# EAGLE schematic ACE2NOKB (EAGLE 9.4.2)
Jupiter Ace Schematic from Bodo Wenzels images. Checked against other sources. With edge connectors from https://jupiter-ace.co.uk/hardware_pcb_eagle.html. John Bradley 2019
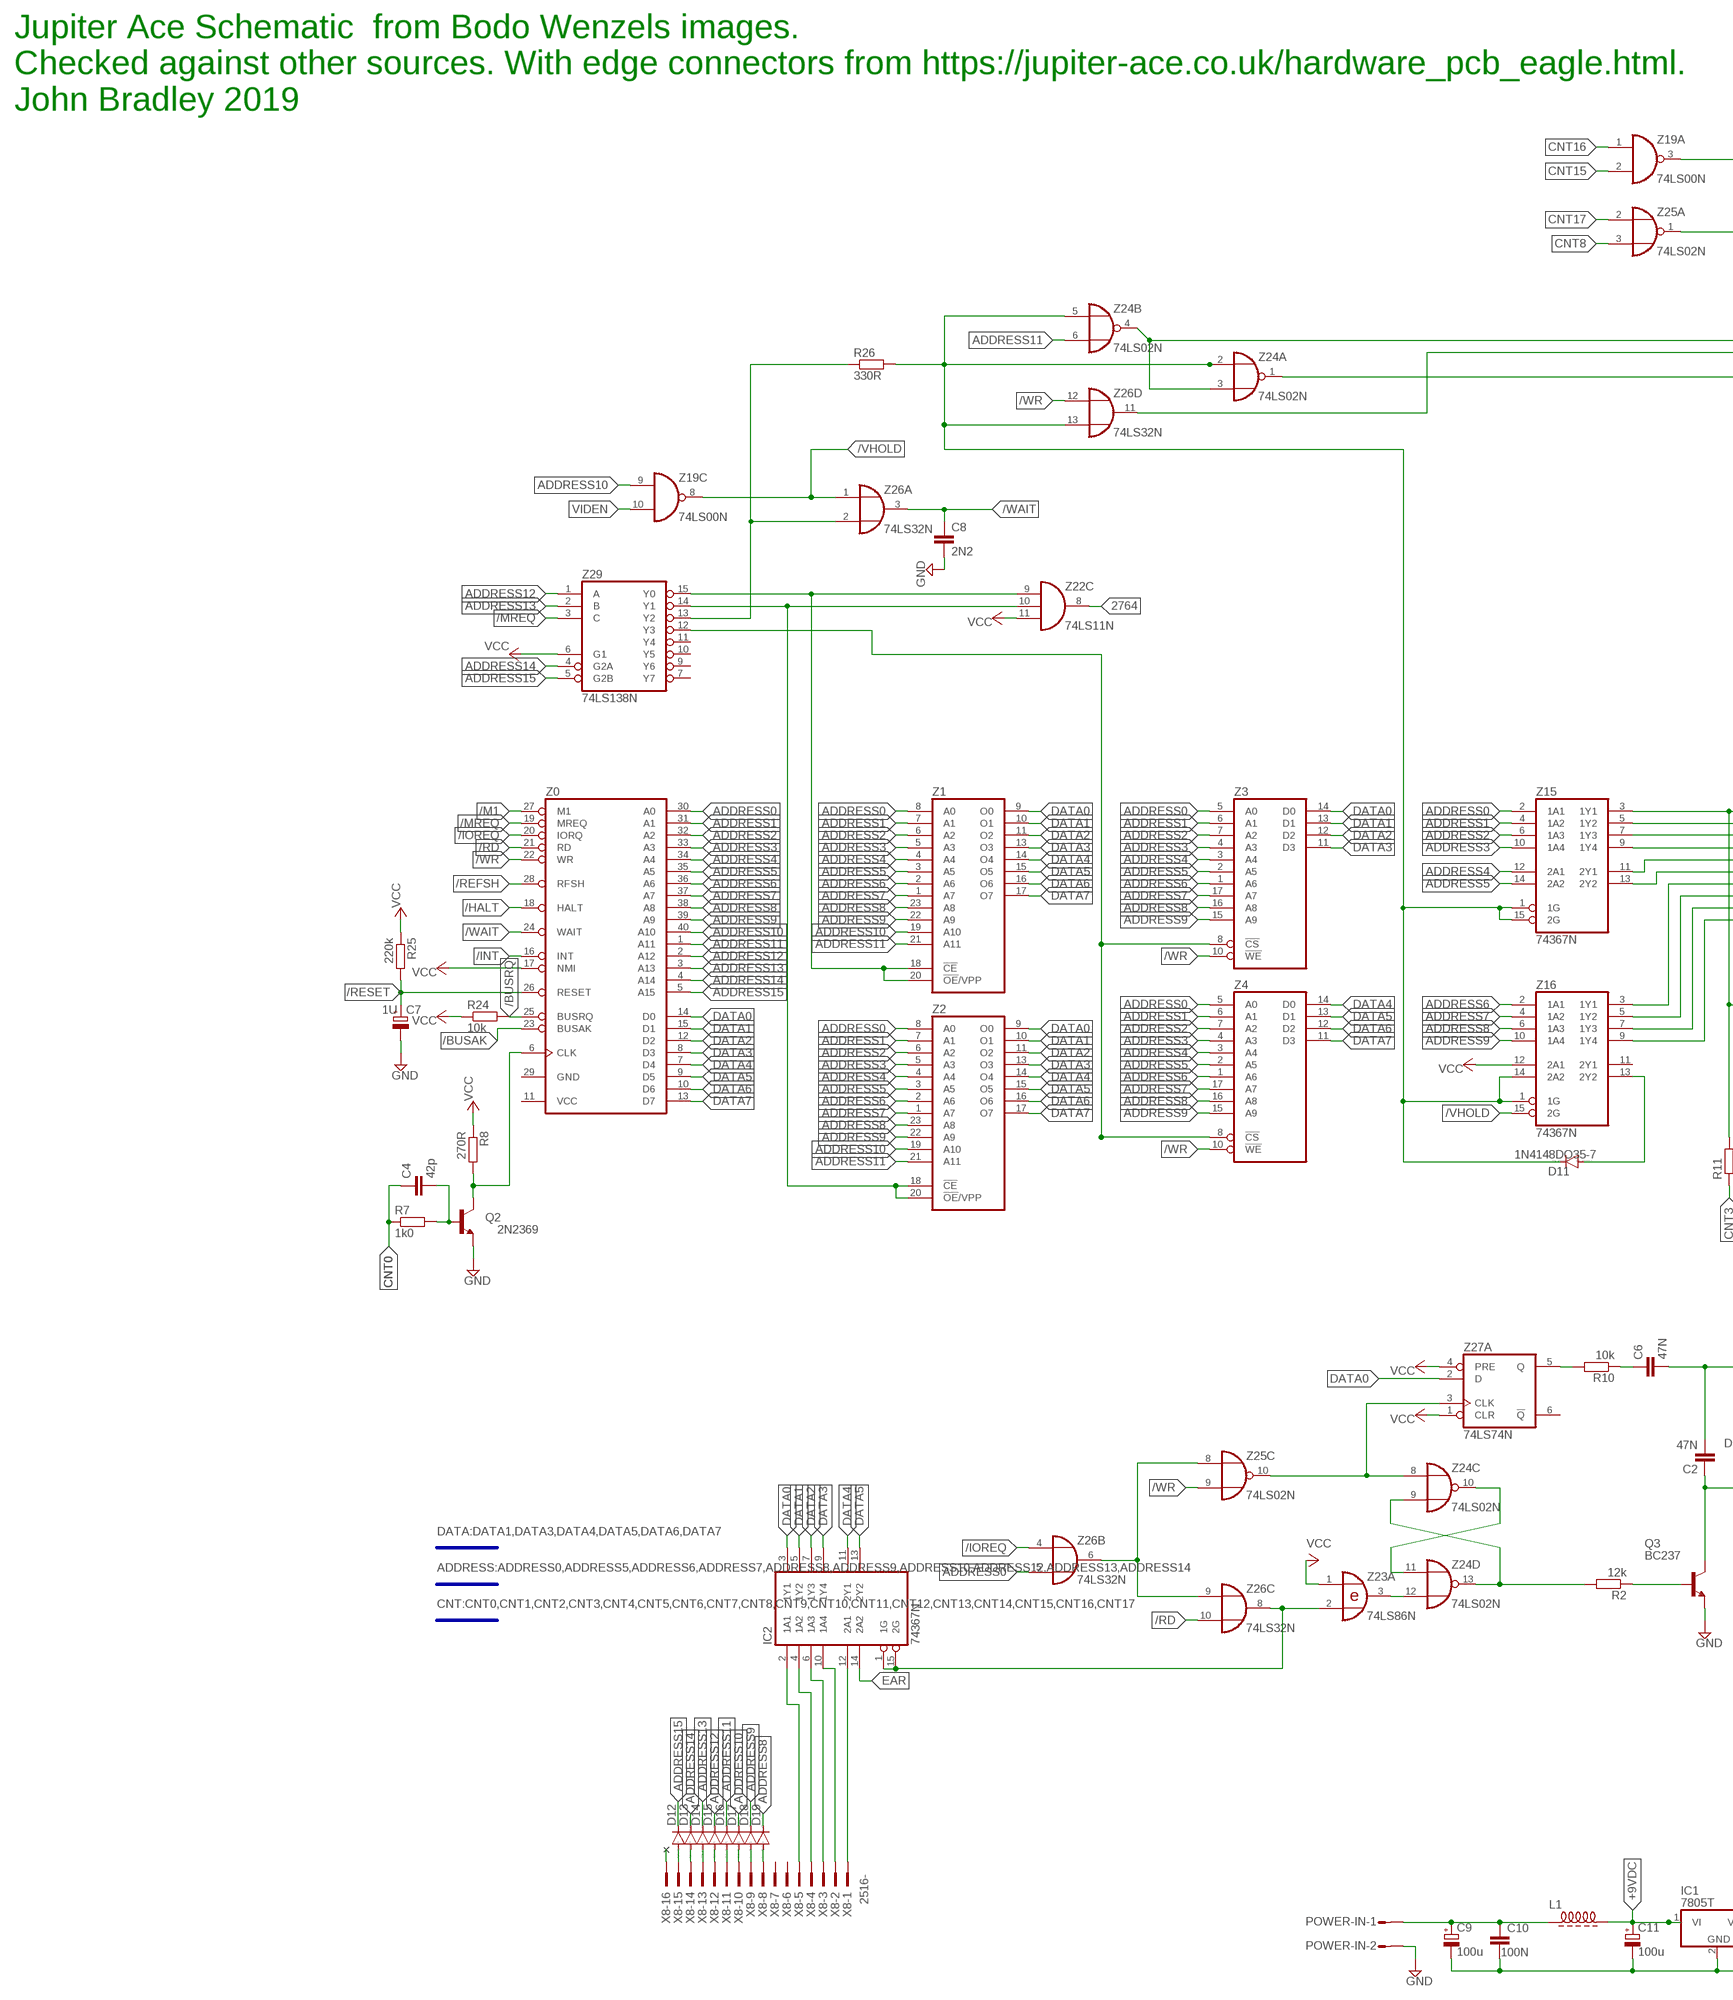
[diagram p0: schematic, sheet 1, part 1 of 2]
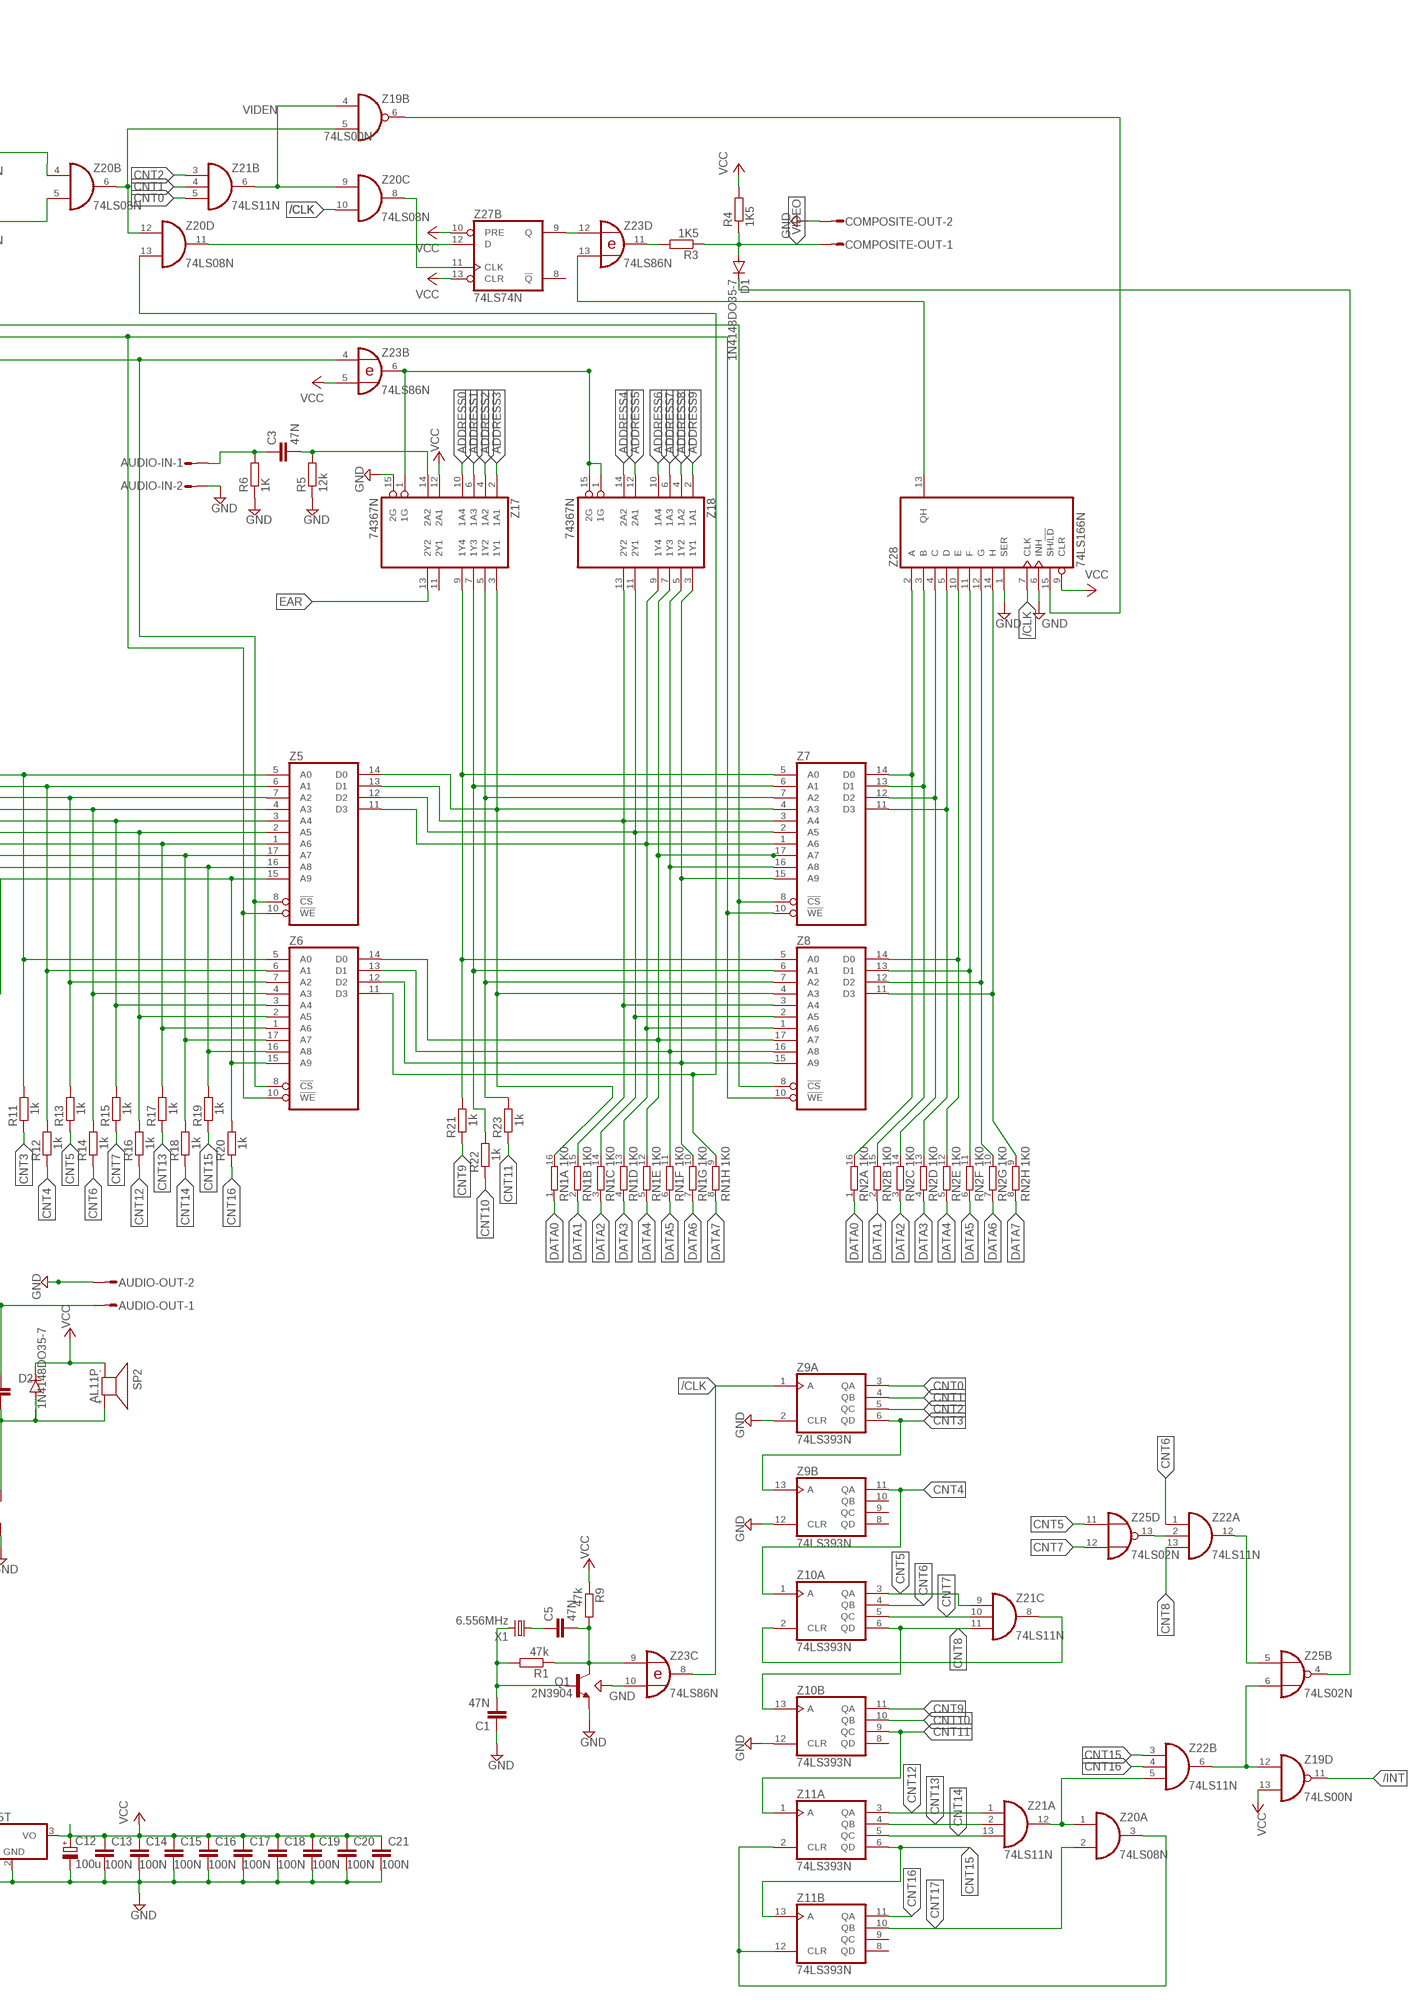
[diagram p1: schematic, sheet 1, part 2 of 2]

## Parts
AUDIO-IN  L02P  [L02P]
AUDIO-OUT  L02P  [L02P]
C1  47N  C-EU025-024X044  [C025-024X044]
C2  47N  C-EU025-024X044  [C025-024X044]
C3  47N  C-EU025-024X044  [C025-024X044]
C4  42p  C-EU025-024X044  [C025-024X044]
C5  47N  C-EU025-024X044  [C025-024X044]
C6  47N  C-EU025-024X044  [C025-024X044]
C7  1U  CPOL-EUE5-5  [E5-5]
C8  2N2  C-EU025-024X044  [C025-024X044]
C9  100u  CPOL-EUE5-5  [E5-5]
C10  100N  C-EU025-024X044  [C025-024X044]
C11  100u  CPOL-EUE5-5  [E5-5]
C12  100u  CPOL-EUE5-5  [E5-5]
C13  100N  C-EU025-024X044  [C025-024X044]
C14  100N  C-EU025-024X044  [C025-024X044]
C15  100N  C-EU025-024X044  [C025-024X044]
C16  100N  C-EU025-024X044  [C025-024X044]
C17  100N  C-EU025-024X044  [C025-024X044]
C18  100N  C-EU025-024X044  [C025-024X044]
C19  100N  C-EU025-024X044  [C025-024X044]
C20  100N  C-EU025-024X044  [C025-024X044]
C21  100N  C-EU025-024X044  [C025-024X044]
COMPOSITE-OUT  L02P  [L02P]
D1  1N4148DO35-7  [DO35-7]
D2  1N4148DO35-7  [DO35-7]
D11  1N4148DO35-7  [DO35-7]
D12  1N4148DO35-7  [DO35-7]
D13  1N4148DO35-7  [DO35-7]
D14  1N4148DO35-7  [DO35-7]
D15  1N4148DO35-7  [DO35-7]
D16  1N4148DO35-7  [DO35-7]
D17  1N4148DO35-7  [DO35-7]
D18  1N4148DO35-7  [DO35-7]
D19  1N4148DO35-7  [DO35-7]
IC1  7805T  [TO220H]
IC2  74367N  [DIL16]
L1  Z14/40CCW  [Z15/4]
POWER-IN  L02P  [L02P]
Q1  2N3904  [TO92]
Q2  2N2369  [TO18]
Q3  BC237  [TO92]
R1  47k  R-EU_0207/2V  [0207/2V]
R2  12k  R-EU_0207/2V  [0207/2V]
R3  1K5  R-EU_0207/2V  [0207/2V]
R4  1K5  R-EU_0207/2V  [0207/2V]
R5  12k  R-EU_0207/2V  [0207/2V]
R6  1K  R-EU_0207/2V  [0207/2V]
R7  1k0  R-EU_0204/7  [0204/7]
R8  270R  R-EU_0207/2V  [0207/2V]
R9  47k  R-EU_0207/2V  [0207/2V]
R10  10k  R-EU_0207/2V  [0207/2V]
R11  1k  R-EU_0207/2V  [0207/2V]
R12  1k  R-EU_0207/2V  [0207/2V]
R13  1k  R-EU_0207/2V  [0207/2V]
R14  1k  R-EU_0207/2V  [0207/2V]
R15  1k  R-EU_0207/2V  [0207/2V]
R16  1k  R-EU_0207/2V  [0207/2V]
R17  1k  R-EU_0207/2V  [0207/2V]
R18  1k  R-EU_0207/2V  [0207/2V]
R19  1k  R-EU_0207/2V  [0207/2V]
R20  1k  R-EU_0207/2V  [0207/2V]
R21  1k  R-EU_0207/2V  [0207/2V]
R22  1k  R-EU_0207/2V  [0207/2V]
R23  1k  R-EU_0207/2V  [0207/2V]
R24  10k  R-EU_0207/2V  [0207/2V]
R25  220k  R-EU_0207/2V  [0207/2V]
R26  330R  R-EU_0204/7  [0204/7]
RN1  1K0  8R-N  [DIL16]
RN2  1K0  8R-N  [DIL16]
SP2  AL11P  [AL11P]
X1  6.556MHz  CRYSTALHC49U-V  [HC49U-V]
X8  2516-  [PAK100/2500-16]
Z0  Z80CPU  [DIL40]
Z1  2732  [DIL24]
Z2  2732  [DIL24]
Z3  2114  [DIL18]
Z4  2114  [DIL18]
Z5  2114  [DIL18]
Z6  2114  [DIL18]
Z7  2114  [DIL18]
Z8  2114  [DIL18]
Z9  74LS393N  [DIL14]
Z10  74LS393N  [DIL14]
Z11  74LS393N  [DIL14]
Z15  74367N  [DIL16]
Z16  74367N  [DIL16]
Z17  74367N  [DIL16]
Z18  74367N  [DIL16]
Z19  74LS00N  [DIL14]
Z20  74LS08N  [DIL14]
Z21  74LS11N  [DIL14]
Z22  74LS11N  [DIL14]
Z23  74LS86N  [DIL14]
Z24  74LS02N  [DIL14]
Z25  74LS02N  [DIL14]
Z26  74LS32N  [DIL14]
Z27  74LS74N  [DIL14]
Z28  74LS166N  [DIL16]
Z29  74LS138N  [DIL16]

## Nets
2764: Z22.8(C:O)
+9VDC: C11.+ IC1.1(VI) L1.2
/BUSAK: Z0.23(BUSAK)
/BUSRQ: R24.2 Z0.25(BUSRQ)
/CLK: Z9.1(A:A) Z20.10(C:I1) Z23.8(C:O) Z28.7(CLK)
/HALT: Z0.18(HALT)
/INT: Z0.16(INT) Z19.11(D:O)
/IOREQ: Z0.20(IORQ) Z26.4(B:I0)
/M1: Z0.27(M1)
/MREQ: Z0.19(MREQ) Z29.3(C)
/RD: Z0.21(RD) Z26.10(C:I1)
/REFSH: Z0.28(RFSH)
/RESET: C7.+ R25.2 Z0.26(RESET)
/VHOLD: Z16.15(2G) Z19.8(C:O) Z26.1(A:I0)
/WAIT: C8.1 Z0.24(WAIT) Z26.3(A:O)
/WR: Z0.22(WR) Z3.10(!WE) Z4.10(!WE) Z25.9(C:I1) Z26.12(D:I0)
ADDRESS0: Z0.30(A0) Z1.8(A0) Z2.8(A0) Z3.5(A0) Z4.5(A0) Z15.2(1A1) Z17.10(1A4) Z26.5(B:I1)
ADDRESS1: Z0.31(A1) Z1.7(A1) Z2.7(A1) Z3.6(A1) Z4.6(A1) Z15.4(1A2) Z17.6(1A3)
ADDRESS2: Z0.32(A2) Z1.6(A2) Z2.6(A2) Z3.7(A2) Z4.7(A2) Z15.6(1A3) Z17.4(1A2)
ADDRESS3: Z0.33(A3) Z1.5(A3) Z2.5(A3) Z3.4(A3) Z4.4(A3) Z15.10(1A4) Z17.2(1A1)
ADDRESS4: Z0.34(A4) Z1.4(A4) Z2.4(A4) Z3.3(A4) Z4.3(A4) Z15.12(2A1) Z18.14(2A2)
ADDRESS5: Z0.35(A5) Z1.3(A5) Z2.3(A5) Z3.2(A5) Z4.2(A5) Z15.14(2A2) Z18.12(2A1)
ADDRESS6: Z0.36(A6) Z1.2(A6) Z2.2(A6) Z3.1(A6) Z4.1(A6) Z16.2(1A1) Z18.10(1A4)
ADDRESS7: Z0.37(A7) Z1.1(A7) Z2.1(A7) Z3.17(A7) Z4.17(A7) Z16.4(1A2) Z18.6(1A3)
ADDRESS8: D19.C Z0.38(A8) Z1.23(A8) Z2.23(A8) Z3.16(A8) Z4.16(A8) Z16.6(1A3) Z18.4(1A2)
ADDRESS9: D18.C Z0.39(A9) Z1.22(A9) Z2.22(A9) Z3.15(A9) Z4.15(A9) Z16.10(1A4) Z18.2(1A1)
ADDRESS10: D17.C Z0.40(A10) Z1.19(A10) Z2.19(A10) Z19.9(C:I0)
ADDRESS11: D16.C Z0.1(A11) Z1.21(A11) Z2.21(A11) Z24.6(B:I1)
ADDRESS12: D15.C Z0.2(A12) Z29.1(A)
ADDRESS13: D14.C Z0.3(A13) Z29.2(B)
ADDRESS14: D13.C Z0.4(A14) Z29.4(G2A)
ADDRESS15: D12.C Z0.5(A15) Z29.5(G2B)
CNT0: C4.1 R7.1 Z9.3(A:QA) Z21.5(B:I2)
CNT1: Z9.4(A:QB) Z21.4(B:I1)
CNT2: Z9.5(A:QC) Z21.3(B:I0)
CNT3: R11.1 Z9.6(A:QD) Z9.13(B:A)
CNT4: R12.1 Z9.11(B:QA) Z10.1(A:A)
CNT5: R13.1 Z10.3(A:QA) Z21.9(C:I0) Z25.11(D:I0)
CNT6: R14.1 Z10.4(A:QB) Z22.1(A:I0)
CNT7: R15.1 Z10.5(A:QC) Z21.10(C:I1) Z25.12(D:I1)
CNT8: Z10.6(A:QD) Z10.13(B:A) Z21.11(C:I2) Z22.13(A:I2) Z25.3(A:I1)
CNT9: R21.1 Z10.11(B:QA)
CNT10: R22.1 Z10.10(B:QB)
CNT11: R23.1 Z10.9(B:QC) Z11.1(A:A)
CNT12: R16.1 Z11.3(A:QA) Z21.1(A:I0)
CNT13: R17.1 Z11.4(A:QB) Z21.2(A:I1)
CNT14: R18.1 Z11.5(A:QC) Z21.13(A:I2)
CNT15: R19.1 Z11.6(A:QD) Z11.13(B:A) Z19.2(A:I1) Z22.3(B:I0)
CNT16: R20.1 Z11.11(B:QA) Z19.1(A:I0) Z22.4(B:I1)
CNT17: Z11.10(B:QB) Z20.2(A:I1) Z25.2(A:I0)
DATA0: IC2.3(1Y1) RN1.1 RN2.1 Z0.14(D0) Z1.9(O0) Z2.9(O0) Z3.14(D0) Z27.2(A:D)
DATA1: IC2.5(1Y2) RN1.2 RN2.2 Z0.15(D1) Z1.10(O1) Z2.10(O1) Z3.13(D1)
DATA2: IC2.7(1Y3) RN1.3 RN2.3 Z0.12(D2) Z1.11(O2) Z2.11(O2) Z3.12(D2)
DATA3: IC2.9(1Y4) RN1.4 RN2.4 Z0.8(D3) Z1.13(O3) Z2.13(O3) Z3.11(D3)
DATA4: IC2.11(2Y1) RN1.5 RN2.5 Z0.7(D4) Z1.14(O4) Z2.14(O4) Z4.14(D0)
DATA5: IC2.13(2Y2) RN1.6 RN2.6 Z0.9(D5) Z1.15(O5) Z2.15(O5) Z4.13(D1)
DATA6: RN1.7 RN2.7 Z0.10(D6) Z1.16(O6) Z2.16(O6) Z4.12(D2)
DATA7: RN1.8 RN2.8 Z0.13(D7) Z1.17(O7) Z2.17(O7) Z4.11(D3)
EAR: IC2.14(2A2) Z17.13(2Y2)
GND: AUDIO-IN.2 AUDIO-OUT.2 C1.1 C7.- C8.2 C9.- C10.1 C11.- C12.- C13.1 C14.1 C15.1 C16.1 C17.1 C18.1 C19.1 C20.1 C21.1 COMPOSITE-OUT.2 IC1.2(GND) POWER-IN.2 Q1.3(E) Q2.1(E) Q3.1(E) R5.1 R6.1 Z9.2(A:CLR) Z9.12(B:CLR) Z10.12(B:CLR) Z17.15(2G) Z23.10(C:I1) Z28.1(SER) Z28.6(INH)
N$1: Z1.18(!CE) Z1.20(!OE!/VPP) Z22.9(C:I0) Z29.15(Y0)
N$2: R26.1 Z26.2(A:I1) Z29.13(Y2)
N$3: Z2.18(!CE) Z2.20(!OE!/VPP) Z22.10(C:I1) Z29.14(Y1)
N$4: C3.2 R5.2 Z17.14(2A2)
N$5: R11.2 Z5.5(A0) Z6.5(A0) Z15.3(1Y1)
N$6: Z7.8(!CS) Z8.8(!CS) Z24.3(A:I1) Z24.4(B:O)
N$7: Z5.8(!CS) Z6.8(!CS) Z23.4(B:I0) Z24.1(A:O)
N$8: Z5.10(!WE) Z6.10(!WE) Z7.10(!WE) Z8.10(!WE) Z26.11(D:O)
N$9: X8.16
N$10: Z19.3(A:O) Z20.4(B:I0)
N$11: Z20.5(B:I1) Z25.1(A:O)
N$12: AUDIO-IN.1 C3.1 R6.2
N$13: R12.2 Z5.6(A1) Z6.6(A1) Z15.5(1Y2)
N$14: Z20.11(D:O) Z27.12(B:D)
N$15: Z20.8(C:O) Z27.11(B:CLK)
N$16: IC2.12(2A1) X8.1
N$17: Z23.12(D:I0) Z27.9(B:Q)
N$18: Z23.13(D:I1) Z28.13(QH)
N$19: R3.2 Z23.11(D:O)
N$20: RN1.12 Z6.14(D0) Z7.17(A7) Z8.17(A7) Z18.7(1Y3)
N$21: Z17.1(1G) Z18.1(1G) Z18.15(2G) Z23.6(B:O)
N$22: Z19.6(B:O) Z28.15(SH/!LD)
N$23: IC2.10(1A4) X8.2
N$24: Q2.3(C) R8.2 Z0.6(CLK)
N$25: IC2.1(1G) IC2.15(2G) Z23.2(A:I1) Z26.8(C:O)
N$26: C4.2 Q2.2(B) R7.2
N$27: D12.A X8.15
N$28: Z3.8(!CS) Z4.8(!CS) Z29.12(Y3)
N$29: D13.A X8.14
N$30: R13.2 Z5.7(A2) Z6.7(A2) Z15.7(1Y3)
N$31: Z25.8(C:I0) Z26.6(B:O) Z26.9(C:I0)
N$32: R14.2 Z5.4(A3) Z6.4(A3) Z15.9(1Y4)
N$33: C5.2 Q1.1(C) R1.1 R9.2 Z23.9(C:I0)
N$34: Z24.10(C:O) Z24.11(D:I0)
N$35: Z24.8(C:I0) Z25.10(C:O) Z27.3(A:CLK)
N$36: C5.1 X1.1
N$37: R15.2 Z5.3(A4) Z6.3(A4) Z15.11(2Y1)
N$38: R2.2 Z24.9(C:I1) Z24.13(D:O)
N$39: Z23.3(A:O) Z24.12(D:I1)
N$40: Q3.2(B) R2.1
N$41: R10.2 Z27.5(A:Q)
N$42: C6.1 R10.1
N$43: AUDIO-OUT.1 C2.2 C6.2
N$44: C2.1 D2.A Q3.3(C) SP2.+
N$45: R16.2 Z5.2(A5) Z6.2(A5) Z15.13(2Y2)
N$46: R17.2 Z5.1(A6) Z6.1(A6) Z16.3(1Y1)
N$47: C1.2 Q1.2(B) R1.2 X1.2
N$48: R18.2 Z5.17(A7) Z6.17(A7) Z16.5(1Y2)
N$49: Z20.1(A:I0) Z21.12(A:O) Z22.5(B:I2)
N$50: Z19.12(D:I0) Z22.6(B:O) Z25.6(B:I1)
N$51: D1.C Z25.4(B:O)
N$52: Z22.2(A:I1) Z25.13(D:O)
N$53: D14.A X8.13
N$54: Z10.2(A:CLR) Z21.8(C:O)
N$55: Z11.2(A:CLR) Z11.12(B:CLR) Z20.3(A:O)
N$56: D15.A X8.12
N$57: D16.A X8.11
N$58: D17.A X8.10
N$59: Z22.12(A:O) Z25.5(B:I0)
N$60: D18.A X8.9
N$61: D19.A X8.8
N$65: C9.+ C10.2 L1.1 POWER-IN.1
N$67: R19.2 Z5.16(A8) Z6.16(A8) Z16.7(1Y3)
N$68: R20.2 Z5.15(A9) Z6.15(A9) Z16.9(1Y4)
N$69: D11.A Z16.13(2Y2)
N$70: RN1.9 Z6.11(D3) Z20.13(D:I1)
N$71: R21.2 Z7.5(A0) Z8.5(A0) Z17.9(1Y4)
N$73: R22.2 Z7.6(A1) Z8.6(A1) Z17.7(1Y3)
N$74: R23.2 Z7.7(A2) Z8.7(A2) Z17.5(1Y2)
N$75: RN1.16 Z5.14(D0) Z7.4(A3) Z8.4(A3) Z17.3(1Y1)
N$76: RN1.15 Z5.13(D1) Z7.3(A4) Z8.3(A4) Z18.13(2Y2)
N$81: RN1.14 Z5.12(D2) Z7.2(A5) Z8.2(A5) Z18.11(2Y1)
N$82: RN1.13 Z5.11(D3) Z7.1(A6) Z8.1(A6) Z18.9(1Y4)
N$84: RN1.11 Z6.13(D1) Z7.16(A8) Z8.16(A8) Z18.5(1Y2)
N$85: RN1.10 Z6.12(D2) Z7.15(A9) Z8.15(A9) Z18.3(1Y1)
N$86: D11.C R26.2 Z15.1(1G) Z15.15(2G) Z16.1(1G) Z16.14(2A2) Z24.2(A:I0) Z24.5(B:I0) Z26.13(D:I1)
N$90: RN2.9 Z8.11(D3) Z28.14(H)
N$91: RN2.16 Z7.14(D0) Z28.2(A)
N$92: RN2.15 Z7.13(D1) Z28.3(B)
N$93: RN2.14 Z7.12(D2) Z28.4(C)
N$94: RN2.13 Z7.11(D3) Z28.5(D)
N$95: RN2.12 Z8.14(D0) Z28.10(E)
N$96: RN2.11 Z8.13(D1) Z28.11(F)
N$97: RN2.10 Z8.12(D2) Z28.12(G)
N$121: IC2.6(1A3) X8.3
N$123: IC2.2(1A1) X8.5
N$125: IC2.4(1A2) X8.4
S7BALPHA: Z19.5(B:I1) Z20.6(B:O) Z20.12(D:I0)
VCC: C12.+ C13.2 C14.2 C15.2 C16.2 C17.2 C18.2 C19.2 C20.2 C21.2 D2.C IC1.3(VO) R4.2 R8.1 R9.1 R24.1 R25.1 SP2.- Z0.17(NMI) Z16.12(2A1) Z17.12(2A1) Z19.13(D:I1) Z22.11(C:I2) Z23.1(A:I0) Z23.5(B:I1) Z27.1(A:CLR) Z27.4(A:PRE) Z27.10(B:PRE) Z27.13(B:CLR) Z28.9(CLR) Z29.6(G1)
VIDEN: Z19.4(B:I0) Z19.10(C:I1) Z20.9(C:I0) Z21.6(B:O)
VIDEO: COMPOSITE-OUT.1 D1.A R3.1 R4.1
Unconnected: X8.6 X8.7 Z9.8(B:QD) Z9.9(B:QC) Z9.10(B:QB) Z10.8(B:QD) Z11.8(B:QD) Z11.9(B:QC) Z16.11(2Y1) Z17.11(2Y1) Z27.6(A:!Q) Z27.8(B:!Q) Z29.7(Y7) Z29.9(Y6) Z29.10(Y5) Z29.11(Y4)

## Buses
ADDRESS:ADDRESS0,ADDRESS5,ADDRESS6,ADDRESS7,ADDRESS8,ADDRESS9,ADDRESS10,ADDRESS12,ADDRESS13,ADDRESS14
DATA:DATA1,DATA3,DATA4,DATA5,DATA6,DATA7
CNT:CNT0,CNT1,CNT2,CNT3,CNT4,CNT5,CNT6,CNT7,CNT8,CNT9,CNT10,CNT11,CNT12,CNT13,CNT14,CNT15,CNT16,CNT17

## Notes on the sheet
- Jupiter Ace Schematic  from Bodo Wenzels images.
  Checked against other sources. With edge connectors from https://jupiter-ace.co.uk/hardware_pcb_eagle.html.
  John Bradley 2019

## Power pins joined to a net without a drawn wire
GND: IC2.8(GND) Z0.29(GND) Z1.12(GND) Z2.12(GND) Z3.9(GND) Z4.9(GND) Z5.9(GND) Z6.9(GND) Z7.9(GND) Z8.9(GND) Z9.7(P:GND) Z10.7(P:GND) Z11.7(P:GND) Z15.8(GND) Z16.8(GND) Z17.8(GND) Z18.8(GND) Z19.7(P:GND) Z20.7(P:GND) Z21.7(P:GND) Z22.7(P:GND) Z23.7(P:GND) Z24.7(P:GND) Z25.7(P:GND) Z26.7(P:GND) Z27.7(P:GND) Z28.8(GND) Z29.8(GND)
VCC: IC2.16(VCC) Z0.11(VCC) Z1.24(VCC) Z2.24(VCC) Z3.18(VCC) Z4.18(VCC) Z5.18(VCC) Z6.18(VCC) Z7.18(VCC) Z8.18(VCC) Z9.14(P:VCC) Z10.14(P:VCC) Z11.14(P:VCC) Z15.16(VCC) Z16.16(VCC) Z17.16(VCC) Z18.16(VCC) Z19.14(P:VCC) Z20.14(P:VCC) Z21.14(P:VCC) Z22.14(P:VCC) Z23.14(P:VCC) Z24.14(P:VCC) Z25.14(P:VCC) Z26.14(P:VCC) Z27.14(P:VCC) Z28.16(VCC) Z29.16(VCC)

## Library data of the parts
AUDIO-IN AUDIO-OUT COMPOSITE-OUT POWER-IN = con-amp-mt:L02P: AMP MT CONNECTOR; OC_FARNELL: unknown; OC_NEWARK: unknown
C1-C6 C8 C10 C13-C21 = rcl:C-EU: CAPACITOR, European symbol; SPICEPREFIX: C
C7 C9 C11 C12 = rcl:CPOL-EU: POLARIZED CAPACITOR, European symbol; SPICEPREFIX: C
D1 D2 D11-D19 = diode:1N4148: DIODE high speed (Philips)
IC1 = linear:78*: Positive VOLTAGE REGULATOR Source: http://cache.national.com/ds/LM/LM78L05.pdf http://www.fairchildsemi.com/ds/LM/LM7805.pdf
IC2 Z15-Z18 = 74xx-eu:74*367: Hex BUS DRIVER, 3-state
L1 = inductor-neosid:Z?CCW: CHOKE free-suspension choke/nominal inductance winding counter clockwise; OC_FARNELL: unknown; OC_NEWARK: unknown
Q1 = transistor:2N3904: NPN TRANSISTOR
Q2 = transistor:2N2369: NPN TRANSISTOR
Q3 = transistor:BC237: NPN TRANSISTOR
R1-R26 = rcl:R-EU_: RESISTOR, European symbol; SPICEPREFIX: R
RN1 RN2 = resistor-dil:8R-N: DIL RESISTOR; OC_FARNELL: unknown; OC_NEWARK: unknown
SP2 = buzzer:AL11P: SPEAKER Source: Buerklin; OC_FARNELL: unknown; OC_NEWARK: unknown
X1 = crystal:CRYSTAL: CRYSTAL; OC_FARNELL: 1666969; OC_NEWARK: unknown
X8 = con-3m:2516-: 3M (TM) Pak 100 4-Wall Header Source: 3M; OC_FARNELL: unknown; OC_NEWARK: unknown
Z0 = zilog:Z80CPU: Z80 FAMILY DEVICE
Z1 Z2 = memory:2732: MEMORY
Z3-Z8 = memory:2114: MEMORY
Z9-Z11 = 74xx-eu:74*393: Dual 4-bit decade and binary COUNTER
Z19 = 74xx-eu:74*00: Quad 2-input NAND gate
Z20 = 74xx-eu:74*08: Quad 2-input AND gate
Z21 Z22 = 74xx-eu:74*11: Triple 3-input AND gate
Z23 = 74xx-eu:74*86: Quad 2-input EXCLUSIVE-OR (XOR) gate
Z24 Z25 = 74xx-eu:74*02: Quad 2-input NOR gate
Z26 = 74xx-eu:74*32: Quad 2-input OR gate
Z27 = 74xx-eu:74*74: Dual D type positive edge triggered FLIP FLOP, preset and clear
Z28 = 74xx-eu:74*166: 8-bit parallel load SHIFT REGISTER
Z29 = 74xx-eu:74*138: 3-line to 8-line DECODER/DEMULTIPLEXER